# Altium schematic sheet STM32.SchDoc
size A4; SheetNumber: 1; SheetTotal: 2
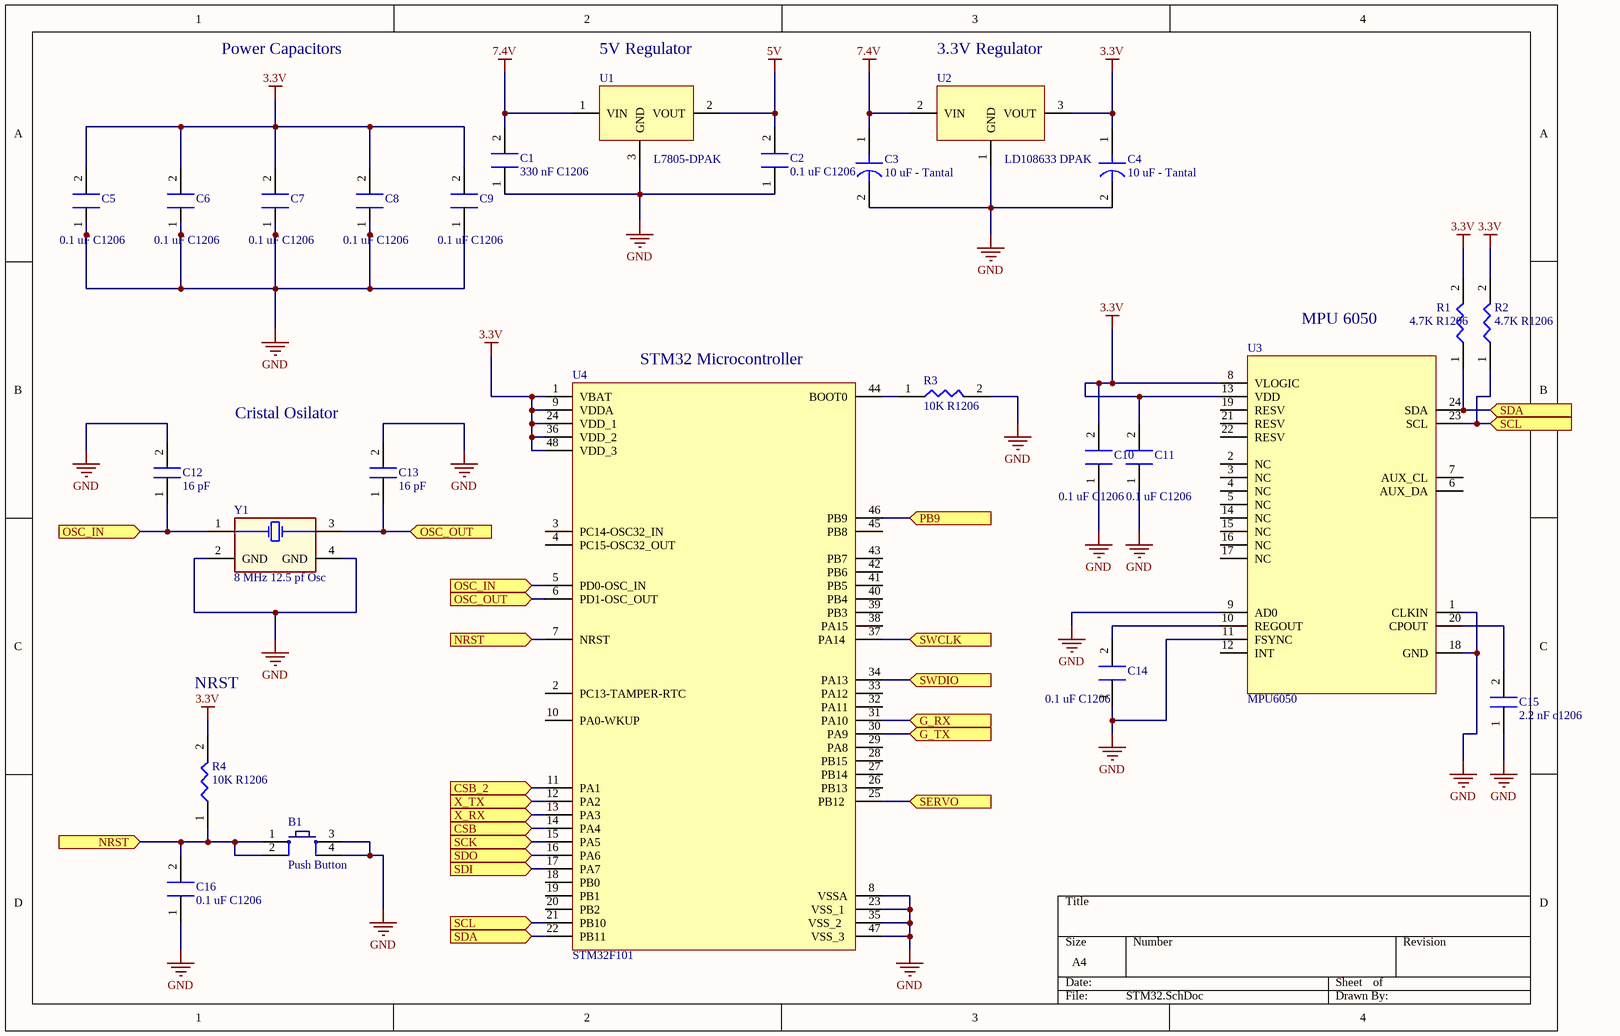
[diagram p0: STM32.SchDoc]

## Parts
B1  Push Button  [PUSB BUTTON-SMD]
C1  330 nF C1206  [C1206]
C2  0.1 uF C1206  [C1206]
C3  10 uF - Tantal  [C1206- TANTAL]
C4  10 uF - Tantal  [C1206- TANTAL]
C5  0.1 uF C1206  [C1206]
C6  0.1 uF C1206  [C1206]
C7  0.1 uF C1206  [C1206]
C8  0.1 uF C1206  [C1206]
C9  0.1 uF C1206  [C1206]
C10  0.1 uF C1206  [C1206]
C11  0.1 uF C1206  [C1206]
C12  16 pF  [C1206]
C13  16 pF  [C1206]
C14  0.1 uF C1206  [C1206]
C15  2.2 nF c1206  [C1206]
C16  0.1 uF C1206  [C1206]
R1  4.7K R1206  [R1206 Resıstor]
R2  4.7K R1206  [R1206 Resıstor]
R3  10K R1206  [R1206 Resıstor]
R4  10K R1206  [R1206 Resıstor]
U1  L7805-DPAK  [DPAK228P972X230-3N]
U2  LD108633 DPAK  [DPAK228P972X230-3N]
U3  MPU6050  [QFN50P400X400X90_HS-25N]
U4  STM32F101  [LQFP48-STM]
Y1  8 MHz 12.5 pf Osc  [8 MHZ Osc.]

## Ports
CSB (in), CSB_2 (in), G_RX (in), G_TX (in), NRST (in), OSC_IN (in), OSC_OUT (in), PB9 (in), SCK (in), SCL (in), SDA (in), SDI (in), SDO (in), SERVO (in), SWCLK (in), SWDIO (in), X_RX (in), X_TX (in)

## Nets
3.3V: C4.1 C5.2 C6.2 C7.2 C8.2 C9.2 C10.2 C11.2 R1.2 R2.2 R4.2 U2.3(VOUT) U3.8(VLOGIC) U3.13(VDD) U4.1(VBAT) U4.9(VDDA) U4.24(VDD_1) U4.36(VDD_2) U4.48(VDD_3)
5V: C2.2 U1.2(VOUT)
7.4V: C1.2 C3.1 U1.1(VIN) U2.2(VIN)
GND: B1.3 B1.4 C1.1 C2.1 C3.2 C4.2 C5.1 C6.1 C7.1 C8.1 C9.1 C10.1 C11.1 C12.2 C13.2 C14.1 C15.1 C16.1 R3.2 U1.3(GND) U2.1(GND) U3.1(CLKIN) U3.9(AD0) U3.11(FSYNC) U3.18(GND) U4.8(VSSA) U4.23(VSS_1) U4.35(VSS_2) U4.47(VSS_3) Y1.2(GND) Y1.4(GND)
CSB: U4.14(PA4) ; port CSB
CSB_2: U4.11(PA1) ; port CSB_2
G_RX: U4.31(PA10) ; port G_RX
G_TX: U4.30(PA9) ; port G_TX
NRST: B1.1 B1.2 C16.2 R4.1 U4.7(NRST) ; port NRST
OSC_IN: C12.1 U4.5(PD0-OSC_IN) Y1.1 ; port OSC_IN
OSC_OUT: C13.1 U4.6(PD1-OSC_OUT) Y1.3 ; port OSC_OUT
PB9: U4.46(PB9) ; port PB9
SCK: U4.15(PA5) ; port SCK
SCL: R2.1 U3.23(SCL) U4.21(PB10) ; port SCL
SDA: R1.1 U3.24(SDA) U4.22(PB11) ; port SDA
SDI: U4.17(PA7) ; port SDI
SDO: U4.16(PA6) ; port SDO
SERVO: U4.25(PB12) ; port SERVO
SWCLK: U4.37(PA14) ; port SWCLK
SWDIO: U4.34(PA13) ; port SWDIO
X_RX: U4.13(PA3) ; port X_RX
X_TX: U4.12(PA2) ; port X_TX
NetC14_2: C14.2 U3.10(REGOUT)
NetC15_2: C15.2 U3.20(CPOUT)
NetR3_1: R3.1 U4.44(BOOT0)

Not connected (* = marked no-connect by the designer): U3 2(NC) 3(NC) 4(NC) 5(NC) 6(AUX_DA) 7(AUX_CL) 12(INT) 14(NC) 15(NC) 16(NC) 17(NC) 19(RESV) 21(RESV) 22(RESV); U4 2(PC13-TAMPER-RTC) 3(PC14-OSC32_IN) 4(PC15-OSC32_OUT) 10(PA0-WKUP) 18(PB0) 19(PB1) 20(PB2) 26(PB13) 27(PB14) 28(PB15) 29(PA8) 32(PA11) 33(PA12) 38(PA15) 39(PB3) 40(PB4) 41(PB5) 42(PB6) 43(PB7) 45(PB8)

## Notes on the sheet
- Power Capacitors
- 5V Regulator
- 3.3V Regulator
- (near U4) STM32 Microcontroller
- MPU 6050
- (near C13) Cristal Osilator
- NRST

## Library data of the parts
B1 = Push Button: Smd Push Button; Satın Alma Linki: https://urun.n11.com/diger/mini-pushbutton-switch-smd-P227461537?gclid=Cj0KCQjwkoDmBRCcARIsAG3xzl8Y_-jeD7HocNM6lvuZ_rVp83568XPGtNzlPwXWLph8oCRqo0yh87UaApZYEALw_wcB&gclsrc=aw.ds
U1 = L7805-DPAK: L7805 5V REGULATOR. SMD PAKET
U2 = LD108633 DPAK: LD1086 3.3V REGULATOR
U3 = MPU6050: MPU6050 GYRO
U4 = STM32F101: STM32F101 48 PİNLİ MİKROİŞLEMCİ